# Altium project HeadControllerMILANDR.PrjPcb
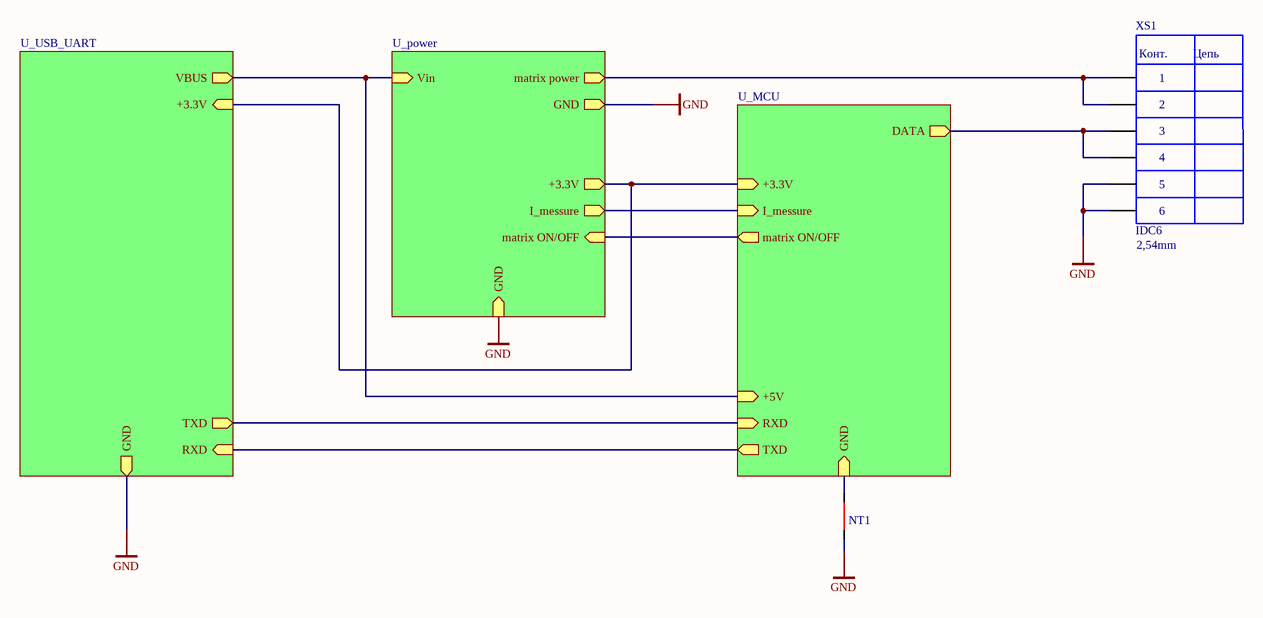
[diagram p0: HeadController.SchDoc]
4 sheets, 73 parts. Net scope: hierarchical (ports join the sheet entries above them; power ports are global).
Board file: HeadController_1.PcbDoc
Sheets:
  HeadController.SchDoc
    U_MCU = MCU.SchDoc
    U_USB_UART = USB_UART.SchDoc
    U_power = power.SchDoc

## Sheet HeadController.SchDoc
size A4

### Parts
NT1  (no value)  [NT]  (net tie, no BOM)
XS1  IDC6  Package: 2,54mm  [IDC-6 (2.54) (end face)]

### Sub-sheets
U_MCU = MCU.SchDoc: GND (in), RXD (in), TXD (out), I_messure (in), +5V (in), DATA (out), matrix ON/OFF (out), +3.3V (in)
U_power = power.SchDoc: Vin (in), I_messure (out), matrix ON/OFF (in), matrix power (out), GND (out), GND (in), +3.3V (out)
U_USB_UART = USB_UART.SchDoc: TXD (out), RXD (in), VBUS (out), GND (out), +3.3V (in)

### Nets
GND: NT1.2 XS1.5 XS1.6 ; sheet U_USB_UART/GND, sheet U_power/GND, sheet U_power/GND
MCU_GND: NT1.1 ; sheet U_MCU/GND
MCU_VCC: sheet U_MCU/+3.3V, sheet U_USB_UART/+3.3V, sheet U_power/+3.3V
OLED_VCC: sheet U_MCU/+5V, sheet U_USB_UART/VBUS, sheet U_power/Vin
I_MES: sheet U_MCU/I_messure, sheet U_power/I_messure
MATRIX_ON: sheet U_MCU/matrix ON/OFF, sheet U_power/matrix ON/OFF
UART1_RXD: sheet U_MCU/RXD, sheet U_USB_UART/TXD
UART1_TXD: sheet U_MCU/TXD, sheet U_USB_UART/RXD
NetDD3_4: XS1.3 XS1.4 ; sheet U_MCU/DATA
NetVT2_3: XS1.1 XS1.2 ; sheet U_power/matrix power

### Notes on the sheet
- (in symbol IDC6) Конт.; Цепь

### Library data of the parts
NT1 = NT
XS1 = IDC6: ValueBOM: Разъём IDC6 прямой; Type: XS; Value: IDC6

## Sheet MCU.SchDoc
size A2
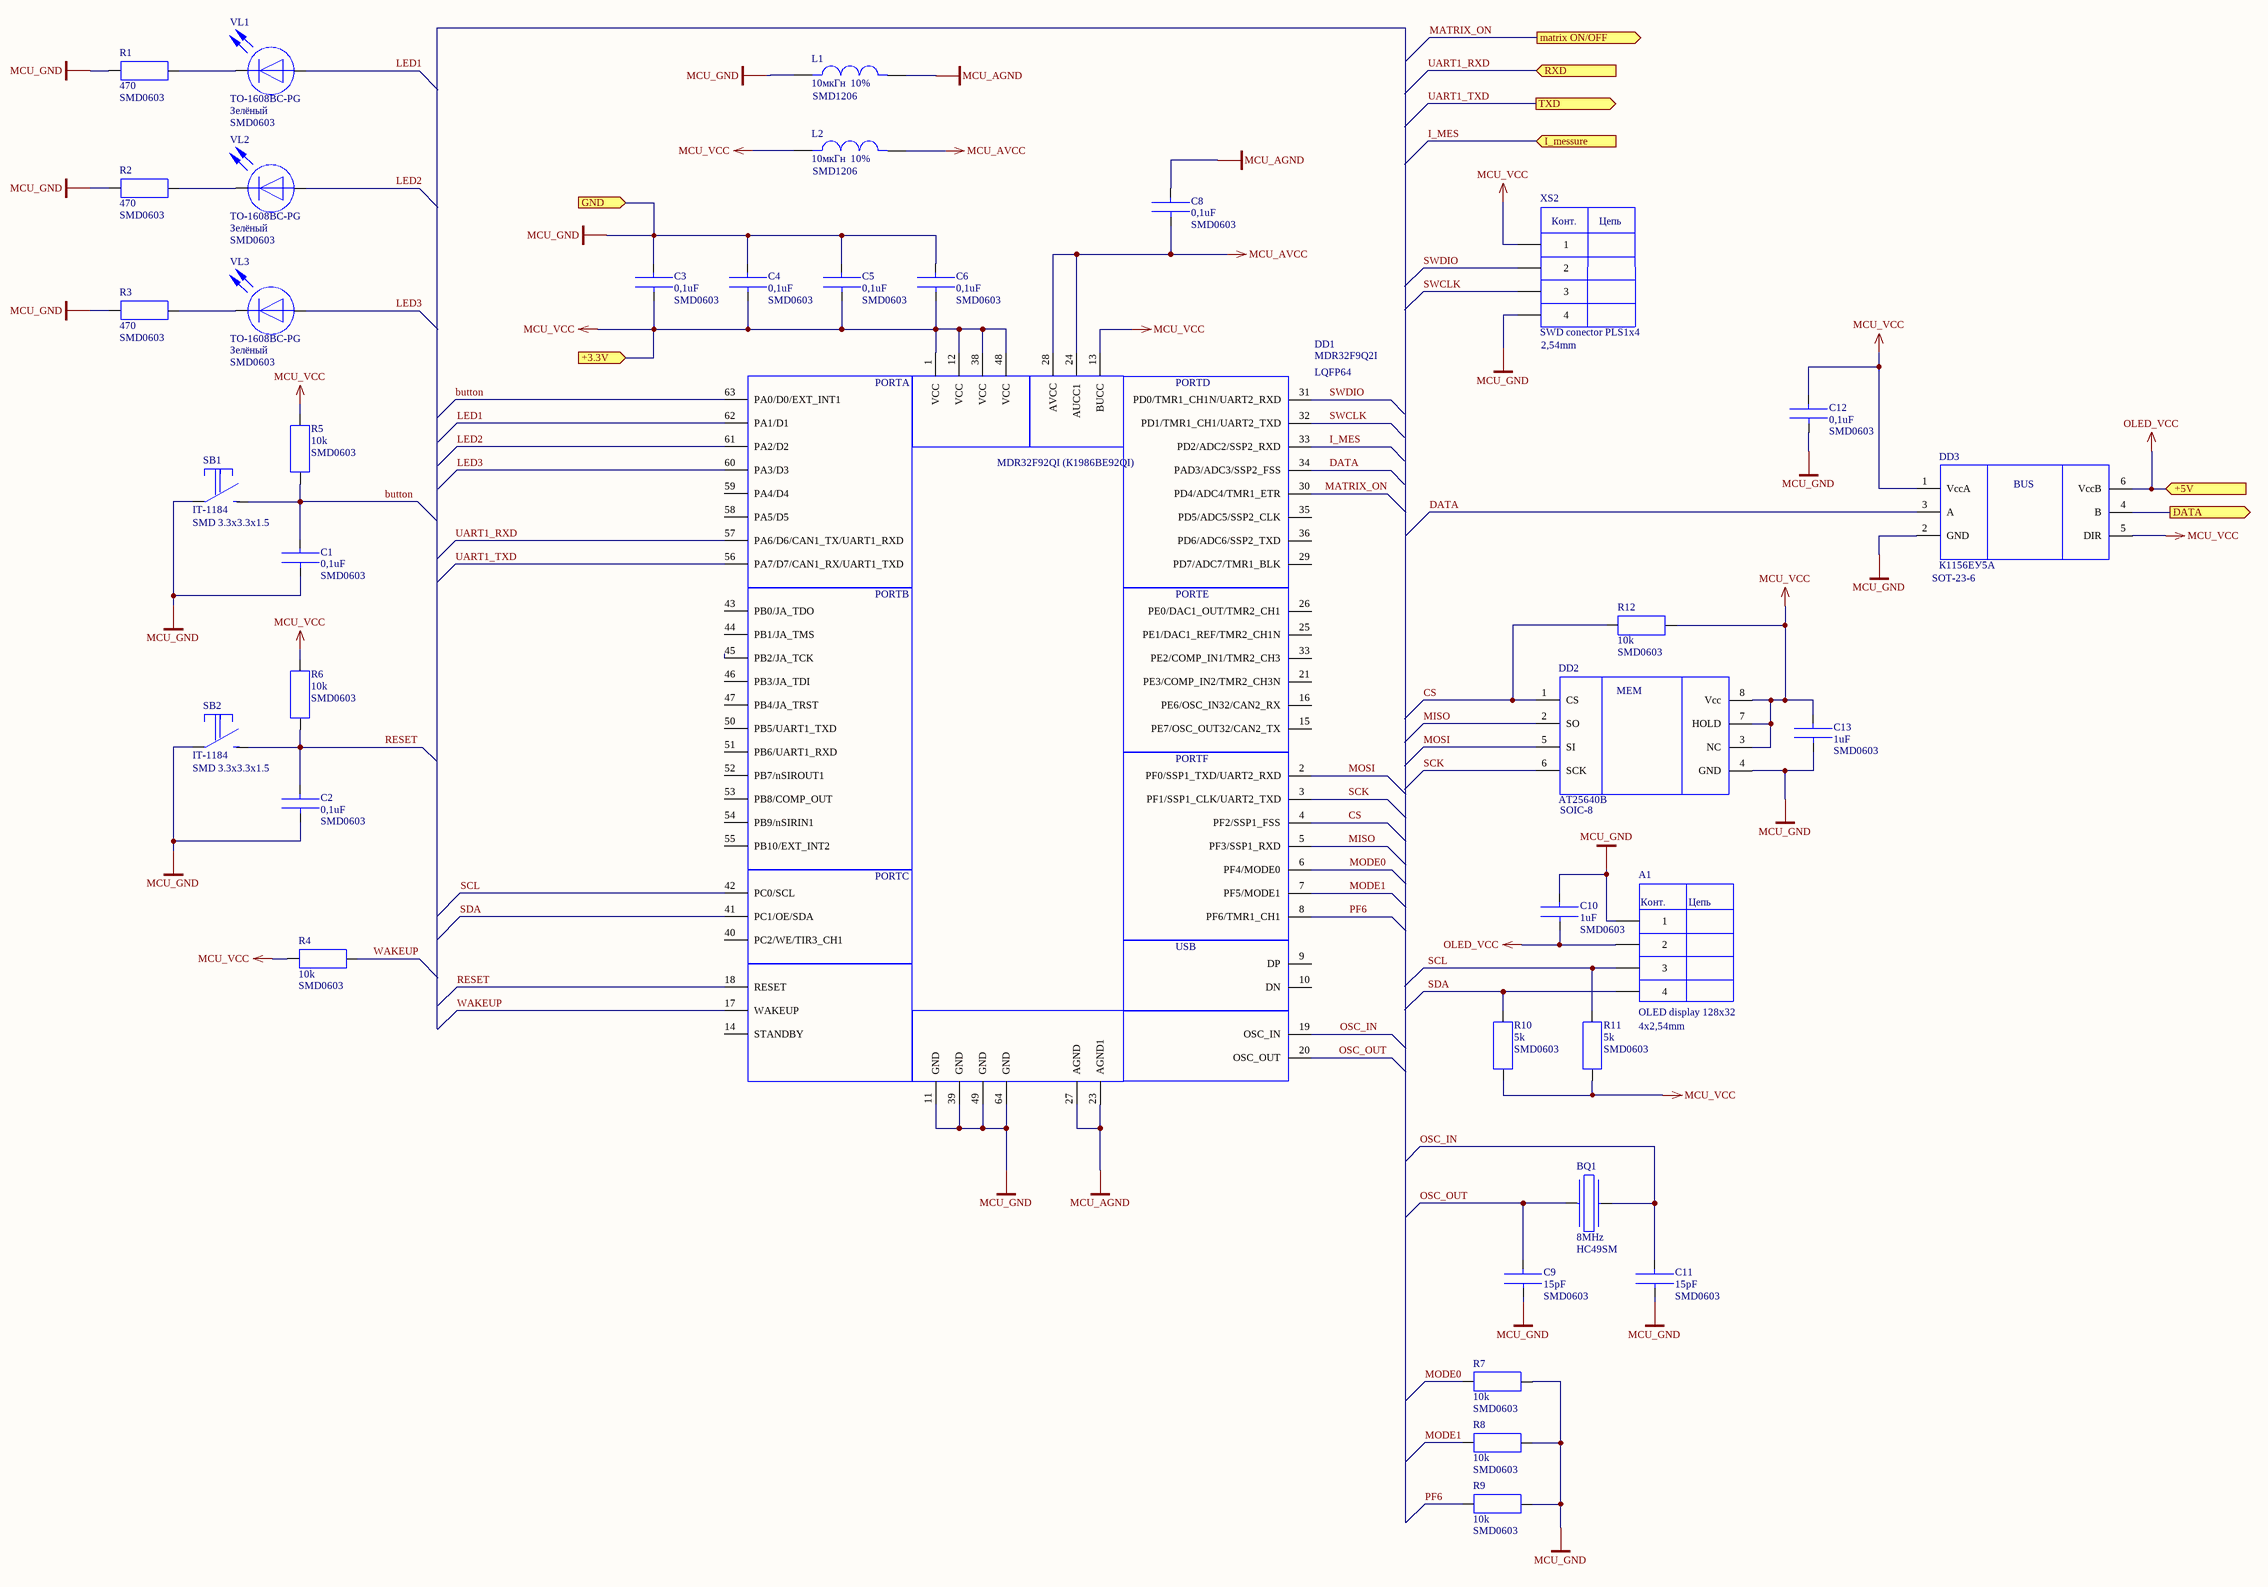
[diagram p1: MCU.SchDoc]

### Parts
A1  OLED display 128x32  Package: 4x2,54mm  [OLED 128x32]
BQ1  8МHz  Package: HC49SM  [BQ_HC49SM]
C1  0,1uF  Package: SMD0603  [SMD0603(1005)]
C2  0,1uF  Package: SMD0603  [SMD0603(1005)]
C3  0,1uF  Package: SMD0603  [SMD0603(1005)]
C4  0,1uF  Package: SMD0603  [SMD0603(1005)]
C5  0,1uF  Package: SMD0603  [SMD0603(1005)]
C6  0,1uF  Package: SMD0603  [SMD0603(1005)]
C8  0,1uF  Package: SMD0603  [SMD0603(1005)]
C9  15pF  Package: SMD0603  [SMD0603(1005)]
C10  1uF  Package: SMD0603  [SMD0603(1005)]
C11  15pF  Package: SMD0603  [SMD0603(1005)]
C12  0,1uF  Package: SMD0603  [SMD0603(1005)]
C13  1uF  Package: SMD0603  [SMD0603(1005)]
DD1  MDR32F9Q2I  Package: LQFP64  [LQFP-64]
DD2  AT25640B  Package: SOIC-8  [SOIC8]
DD3  К1156ЕУ5А  Package: SOT-23-6  [SOT23-6]
L1  10мкГн  10%  Package: SMD1206  [SMD1206(3216)]
L2  10мкГн  10%  Package: SMD1206  [SMD1206(3216)]
R1  470  Package: SMD0603  [SMD0603(1005)]
R2  470  Package: SMD0603  [SMD0603(1005)]
R3  470  Package: SMD0603  [SMD0603(1005)]
R4  10k  Package: SMD0603  [SMD0603(1005)]
R5  10k  Package: SMD0603  [SMD0603(1005)]
R6  10k  Package: SMD0603  [SMD0603(1005)]
R7  10k  Package: SMD0603  [SMD0603(1005)]
R8  10k  Package: SMD0603  [SMD0603(1005)]
R9  10k  Package: SMD0603  [SMD0603(1005)]
R10  5k  Package: SMD0603  [SMD0603(1005)]
R11  5k  Package: SMD0603  [SMD0603(1005)]
R12  10k  Package: SMD0603  [SMD0603(1005)]
SB1  IT-1184  Package: SMD 3.3x3.3x1.5  [IT-1184]
SB2  IT-1184  Package: SMD 3.3x3.3x1.5  [IT-1184]
VL1  TO-1608BC-PG  Light: Зелёный  Package: SMD0603  [LED_SMD0603(1005)]
VL2  TO-1608BC-PG  Light: Зелёный  Package: SMD0603  [LED_SMD0603(1005)]
VL3  TO-1608BC-PG  Light: Зелёный  Package: SMD0603  [LED_SMD0603(1005)]
XS2  SWD conector PLS1x4  Package: 2,54mm  [PLS1x4]

### Ports
+3.3V (in), +5V (in), DATA (out), GND (in), I_messure (in), matrix ON/OFF (out), RXD (in), TXD (out)

### Nets
MCU_AGND: C8.1 DD1.23(AGND1) DD1.27(AGND) L1.2(IN1)
MCU_AVCC: C8.2 DD1.24(AUCC1) DD1.28(AVCC) L2.2(IN1)
MCU_GND: A1.1 C1.2 C2.2 C3.1 C4.1 C5.1 C6.1 C9.1 C10.1 C11.1 C12.2 C13.2 DD1.11(GND) DD1.39(GND) DD1.49(GND) DD1.64(GND) DD2.4(GND) DD3.2(GND) L1.1(IN1) R1.2 R2.2 R3.2 R7.1 R8.1 R9.1 SB1.1 SB2.1 XS2.4 ; port GND
MCU_VCC: C3.2 C4.2 C5.2 C6.2 C12.1 C13.1 DD1.1(VCC) DD1.12(VCC) DD1.13(BUCC) DD1.38(VCC) DD1.48(VCC) DD2.3(NC) DD2.7(HOLD) DD2.8(Vcc) DD3.1(VccA) DD3.5(DIR) L2.1(IN1) R4.2 R5.2 R6.2 R10.1 R11.1 R12.2 XS2.1 ; port +3.3V
OLED_VCC: A1.2 C10.2 DD3.6(VccB) ; port +5V
button: C1.1 DD1.63(PA0/D0/EXT_INT1) R5.1 SB1.2
CS: DD1.4(PF2/SSP1_FSS) DD2.1(CS) R12.1
DATA: DD1.34(PAD3/ADC3/SSP2_FSS) DD3.3(A)
I_MES: DD1.33(PD2/ADC2/SSP2_RXD) ; port I_messure
LED1: DD1.62(PA1/D1) VL1.1
LED2: DD1.61(PA2/D2) VL2.1
LED3: DD1.60(PA3/D3) VL3.1
MATRIX_ON: DD1.30(PD4/ADC4/TMR1_ETR) ; port matrix ON/OFF
MISO: DD1.5(PF3/SSP1_RXD) DD2.2(SO)
MODE0: DD1.6(PF4/MODE0) R7.2
MODE1: DD1.7(PF5/MODE1) R8.2
MOSI: DD1.2(PF0/SSP1_TXD/UART2_RXD) DD2.5(SI)
OSC_IN: BQ1.2 C11.2 DD1.19(OSC_IN)
OSC_OUT: BQ1.1 C9.2 DD1.20(OSC_OUT)
PF6: DD1.8(PF6/TMR1_CH1) R9.2
RESET: C2.1 DD1.18(RESET) R6.1 SB2.2
SCK: DD1.3(PF1/SSP1_CLK/UART2_TXD) DD2.6(SCK)
SCL: A1.3 DD1.42(PC0/SCL) R11.2
SDA: A1.4 DD1.41(PC1/OE/SDA) R10.2
SWCLK: DD1.32(PD1/TMR1_CH1/UART2_TXD) XS2.3
SWDIO: DD1.31(PD0/TMR1_CH1N/UART2_RXD) XS2.2
UART1_RXD: DD1.57(PA6/D6/CAN1_TX/UART1_RXD) ; port RXD
UART1_TXD: DD1.56(PA7/D7/CAN1_RX/UART1_TXD) ; port TXD
WAKEUP: DD1.17(WAKEUP) R4.1
NetDD3_4: DD3.4(B) ; port DATA
NetR1_1: R1.1 VL1.2
NetR2_1: R2.1 VL2.2
NetR3_1: R3.1 VL3.2

Not connected (* = marked no-connect by the designer): DD1 9(DP) 10(DN) 14(STANDBY) 15(PE7/OSC_OUT32/CAN2_TX) 16(PE6/OSC_IN32/CAN2_RX) 21(PE3/COMP_IN2/TMR2_CH3N) 25(PE1/DAC1_REF/TMR2_CH1N) 26(PE0/DAC1_OUT/TMR2_CH1) 29(PD7/ADC7/TMR1_BLK) 35(PD5/ADC5/SSP2_CLK) 36(PD6/ADC6/SSP2_TXD) 40(PC2/WE/TIR3_CH1) 43(PB0/JA_TDO) 44(PB1/JA_TMS) 45(PB2/JA_TCK) 46(PB3/JA_TDI) 47(PB4/JA_TRST) 50(PB5/UART1_TXD) 51(PB6/UART1_RXD) 52(PB7/nSIROUT1) 53(PB8/COMP_OUT) 54(PB9/nSIRIN1) 55(PB10/EXT_INT2) 58(PA5/D5) 59(PA4/D4)

### Notes on the sheet
- Title
- Size:
- Date:
- File:
- A2
- Number:
- Time:
- Revision:
- Sheet
- of
- (in symbol MDR32F9Q2I) PORTA; PORTD; MDR32F92QI (К1986ВЕ92QI); PORTB; PORTE; PORTF; PORTC; USB
- (in symbol PLS1x4) Конт.; Цепь
- (in symbol Дисплей OLED 128x32) Конт.; Цепь
- (in symbol Микросхема AT25640B) MEM
- (in symbol Микросхема SN74LVC1T45DBVR) BUS
- (in symbol OLED) Цепь; Конт.; GND; Vcc; SCL; SDA

### Library data of the parts
A1 = Дисплей OLED 128x32: Type: A; Value: OLED display 128x32; ValueBOM: Дисплей OLED 128x32
BQ1 = BQ_HC49SM: ValueBOM: Кварцевый резонатор 8МГц HC49S; Type: BQ; Value: 8МHz
C1-C6 C8 C12 = CER_CUP_0603: Type: C; ValueBOM: Конденсатор керамический 0,1мкФ SMD 0603 1%; Value: 0,1uF
C9 C11 = CER_CUP_0603: Type: C; ValueBOM: Конденсатор керамический 15пФ SMD 0603 1%; Value: 15pF
C10 C13 = CER_CUP_0603: Type: C; ValueBOM: Конденсатор керамический 1мкФ SMD 0603 1%; Value: 1uF
DD1 = MDR32F9Q2I: ValueBOM: Микроконтроллер MDR32F9Q2I (К1986ВЕ92QI) LQFP64; Type: DD; Value: MDR32F9Q2I
DD2 = Микросхема AT25640B: ValueBOM: Микросхема EEPROM AT25640B; Value: AT25640B; Type: DD
DD3 = Микросхема SN74LVC1T45DBVR: 1-битный шинный приемопередатчик с двуполярным питанием, тремя состояниями на выходе; ValueBOM: Микросхема К1156ЕУ5А; Type: DD; Value: К1156ЕУ5А
L1 L2 = L1: ValueBOM: Индуктивность 10 мкГн, SMD1206, 10%; Type: L; Value: 10мкГн  10%
R1-R3 = R_0603: ValueBOM: Резистор 470 Ом SMD 0603 1%; Type: R; Value: 470
R4-R9 R12 = R_0603: ValueBOM: Резистор 10кОм SMD 0603 1%; Type: R; Value: 10k
R10 R11 = R_0603: ValueBOM: Резистор 5кОм SMD 0603 1%; Type: R; Value: 5k
SB1 SB2 = Кнопка тактовая (универсальная): ValueBOM: Кнопка тактовая IT1184; Type: SB; Value: IT-1184
VL1-VL3 = LED_0603: ValueBOM: Светодиод зелёный TO-1608BC-PG SMD0603; Type: VL; Value: TO-1608BC-PG
XS2 = PLS1x4: ValueBOM: Разъём PLS1x4 прямой; Type: XS; Value: SWD conector PLS1x4

## Sheet USB_UART.SchDoc
size A4
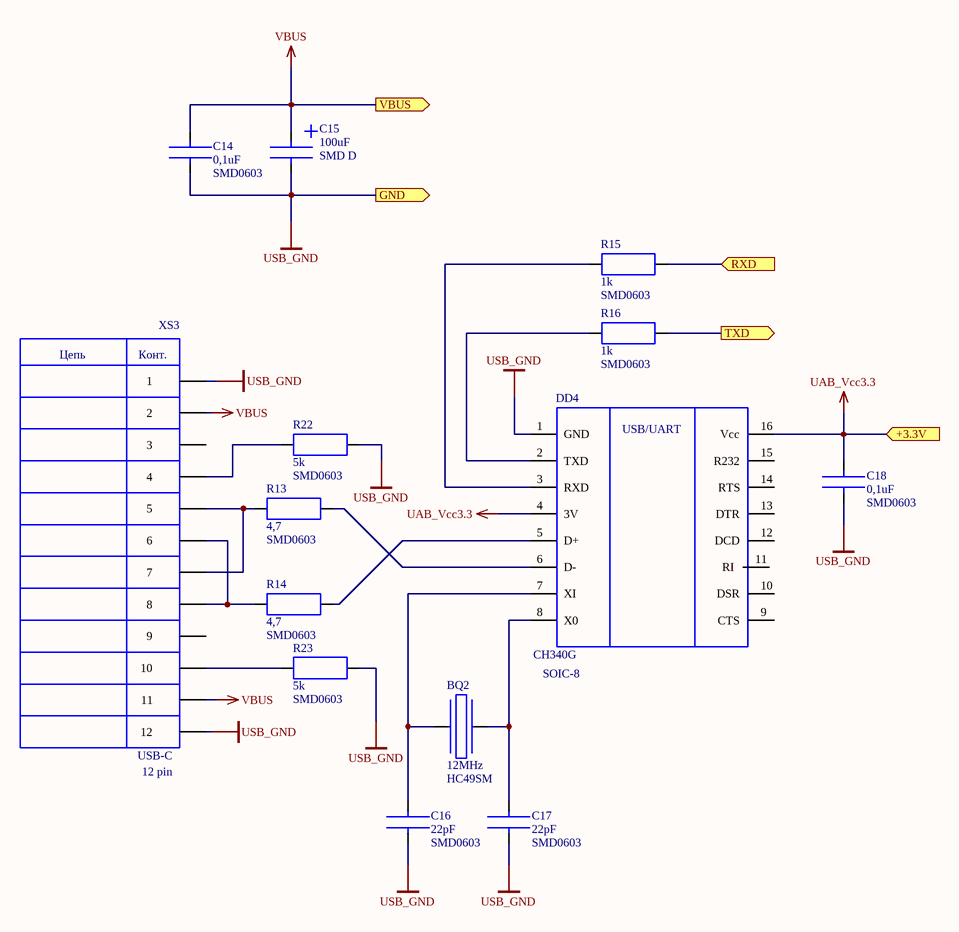
[diagram p2: USB_UART.SchDoc]

### Parts
BQ2  12МHz  Package: HC49SM  [BQ_HC49SM]
C14  0,1uF  Package: SMD0603  [SMD0603(1005)]
C15  100uF  Package: SMD D  [TANT_CAP_D(7343)]
C16  22pF  Package: SMD0603  [SMD0603(1005)]
C17  22pF  Package: SMD0603  [SMD0603(1005)]
C18  0,1uF  Package: SMD0603  [SMD0603(1005)]
DD4  CH340G  Package: SOIC-8  [SOIC16]
R13  4,7  Package: SMD0603  [SMD0603(1005)]
R14  4,7  Package: SMD0603  [SMD0603(1005)]
R15  1k  Package: SMD0603  [SMD0603(1005)]
R16  1k  Package: SMD0603  [SMD0603(1005)]
R22  5k  Package: SMD0603  [SMD0603(1005)]
R23  5k  Package: SMD0603  [SMD0603(1005)]
XS3  USB-C  Package: 12 pin  [USB_C]

### Ports
+3.3V (in), GND (out), RXD (in), TXD (out), VBUS (out)

### Nets
UAB_Vcc3.3: C18.2 DD4.4(3V) DD4.16(Vcc) ; port +3.3V  [project net MCU_VCC]
USB_GND: C14.1 C15.2 C16.1 C17.1 C18.1 DD4.1(GND) R22.1 R23.1 XS3.1 XS3.12 ; port GND  [project net GND]
VBUS: C14.2 C15.1 XS3.2 XS3.11 ; port VBUS  [project net OLED_VCC]
UART1_RXD: R16.1 ; port TXD
UART1_TXD: R15.1 ; port RXD
NetBQ2_1: BQ2.1 C16.2 DD4.7(XI)
NetBQ2_2: BQ2.2 C17.2 DD4.8(X0)
NetDD4_2: DD4.2(TXD) R16.2
NetDD4_3: DD4.3(RXD) R15.2
NetDD4_5: DD4.5(D+) R14.2
NetDD4_6: DD4.6(D-) R13.2
NetR13_1: R13.1 XS3.5 XS3.7
NetR14_1: R14.1 XS3.6 XS3.8
NetR22_2: R22.2 XS3.4
NetR23_2: R23.2 XS3.10

Not connected (* = marked no-connect by the designer): DD4 9(CTS) 10(DSR) 11(RI) 12(DCD) 13(DTR) 14(RTS) 15(R232); XS3 3 9

### Notes on the sheet
- (in symbol USB_C) Цепь; Конт.
- (in symbol Микросхема CH340G) USB/UART

### Library data of the parts
BQ2 = BQ_HC49SM: ValueBOM: Кварцевый резонатор 12МГц HC49S; Type: BQ; Value: 12МHz
C14 C18 = CER_CUP_0603: as C1 on sheet MCU; Value: 0,1uF
C15 = C_TANT_D: Type: C; ValueBOM: Конденсатор танталовый 100мкФ х 16В 10%  SMD D; Value: 100uF
C16 C17 = CER_CUP_0603: Type: C; ValueBOM: Конденсатор керамический 22пФ SMD 0603 1%; Value: 22pF
DD4 = Микросхема CH340G: Type: DD; Value: CH340G; ValueBOM: Микросхема CH340G
R13 R14 = R_0603: ValueBOM: Резистор 4,7Ом SMD 0603 1%; Type: R; Value: 4,7
R15 R16 = R_0603: ValueBOM: Резистор 1кОм SMD 0603 1%; Type: R; Value: 1k
R22 R23 = R_0603: ValueBOM: Резистор 5кОм SMD 0603 1%; Type: R; Value: 5k
XS3 = USB_C: ValueBOM: Разъём USB type C 12 контактный; Value: USB-C; Type: XS; Link: https://www.voltmaster-samara.ru/upload/iblock/68a/68a6841d20080b30588d6f36d0bc1a38.pdf

## Sheet power.SchDoc
size A4
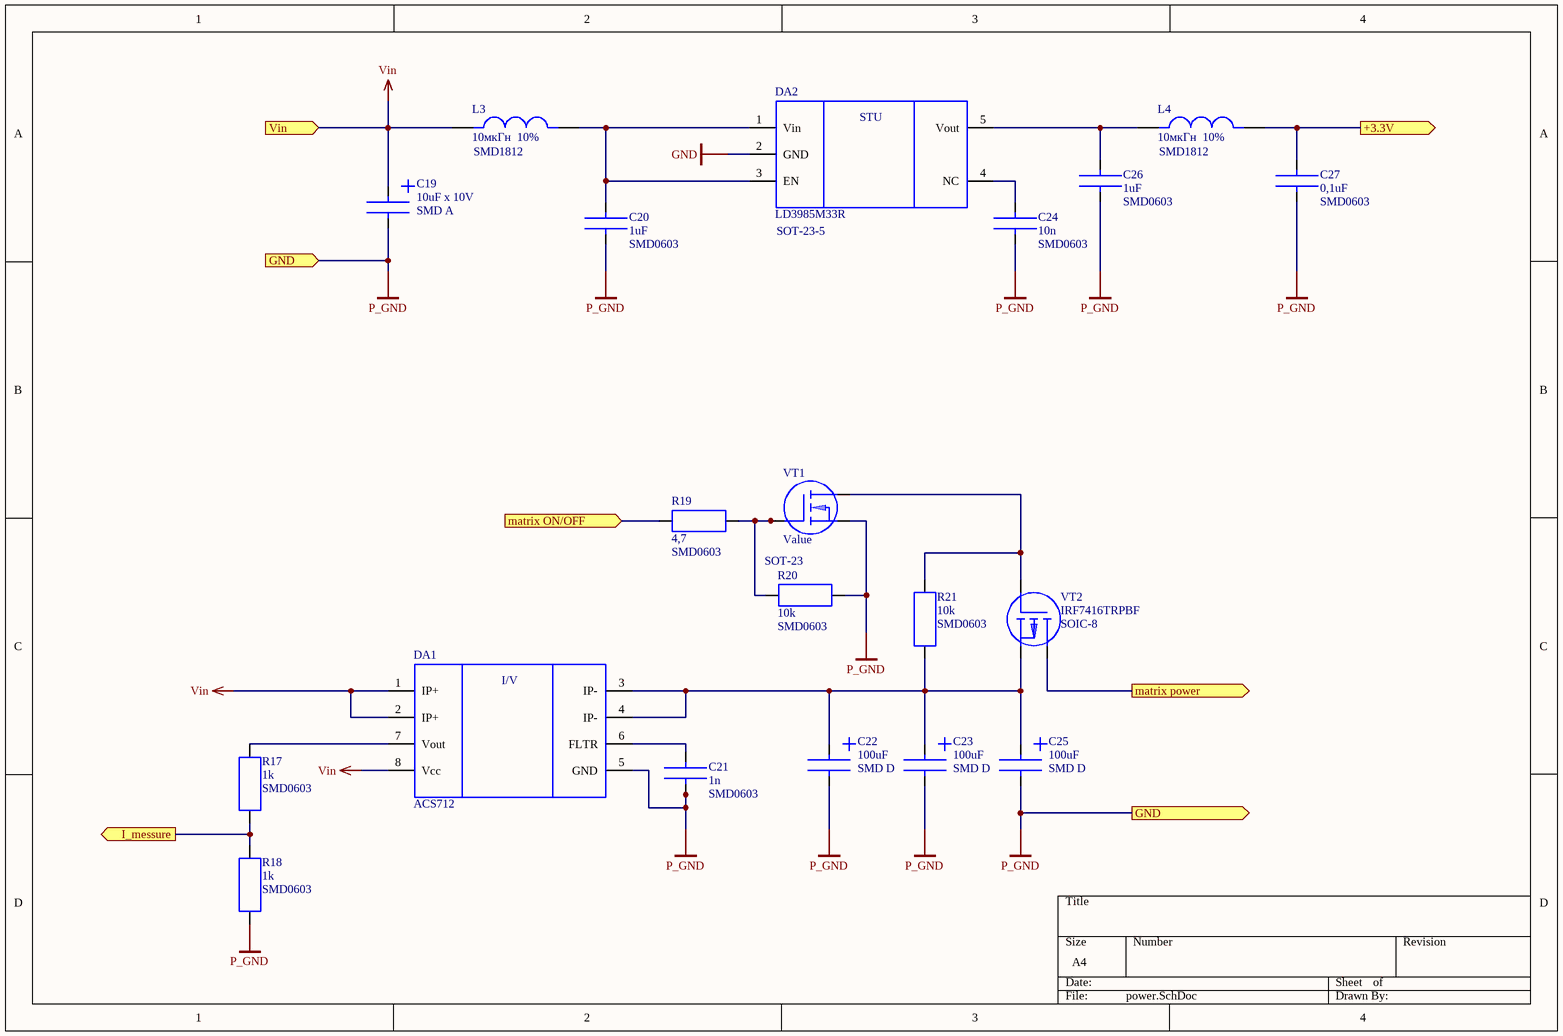
[diagram p3: power.SchDoc]

### Parts
C19  10uF x 10V  Package: SMD A  [TANT_CAP_A(3216)]
C20  1uF  Package: SMD0603  [SMD0603(1005)]
C21  1n  Package: SMD0603  [SMD0603(1005)]
C22  100uF  Package: SMD D  [TANT_CAP_D(7343)]
C23  100uF  Package: SMD D  [TANT_CAP_D(7343)]
C24  10n  Package: SMD0603  [SMD0603(1005)]
C25  100uF  Package: SMD D  [TANT_CAP_D(7343)]
C26  1uF  Package: SMD0603  [SMD0603(1005)]
C27  0,1uF  Package: SMD0603  [SMD0603(1005)]
DA1  ACS712  [SOIC8]
DA2  LD3985M33R  Package: SOT-23-5  [SOT23-5]
L3  10мкГн  10%  Package: SMD1812  [SMD2010(5025)]
L4  10мкГн  10%  Package: SMD1812  [SMD2010(5025)]
R17  1k  Package: SMD0603  [SMD0603(1005)]
R18  1k  Package: SMD0603  [SMD0603(1005)]
R19  4,7  Package: SMD0603  [SMD0603(1005)]
R20  10k  Package: SMD0603  [SMD0603(1005)]
R21  10k  Package: SMD0603  [SMD0603(1005)]
VT1  Value  Package: SOT-23  [SOT23-3]
VT2  IRF7416TRPBF  Package: SOIC-8  [VT_SOIC8]

### Ports
+3.3V (out), GND (in), GND (out), I_messure (out), matrix ON/OFF (in), matrix power (out), Vin (in)

### Nets
GND: C19.2 C20.2 C21.2 C22.2 C23.2 C24.2 C25.2 C26.2 C27.2 DA1.5(GND) DA2.2(GND) R18.2 R20.2 VT1.2 ; port GND  [also labelled P_GND]
MCU_VCC: C27.1 L4.2(IN1) ; port +3.3V
Vin: C19.1 DA1.1(IP+) DA1.2(IP+) DA1.8(Vcc) L3.1(IN1) ; port Vin  [project net OLED_VCC]
I_MES: R17.2 R18.1 ; port I_messure
MATRIX_ON: R19.1 ; port matrix ON/OFF
NetC20_1: C20.1 DA2.1(Vin) DA2.3(EN) L3.2(IN1)
NetC21_1: C21.1 DA1.6(FLTR)
NetC22_1: C22.1 C23.1 C25.1 DA1.3(IP-) DA1.4(IP-) R21.2 VT2.1
NetC24_1: C24.1 DA2.4(NC)
NetC26_1: C26.1 DA2.5(Vout) L4.1(IN1)
NetDA1_7: DA1.7(Vout) R17.1
NetR19_2: R19.2 R20.1 VT1.1
NetR21_1: R21.1 VT1.3 VT2.2
NetVT2_3: VT2.3 ; port matrix power

### Notes on the sheet
- (in symbol LD3985M33R) STU
- (in symbol Микросхема ACS712) I/V

### Library data of the parts
C19 = C_TANT_A: Type: C; ValueBOM: Конденсатор танталовый 10мкФ х 10В SMD A; Value: 10uF x 10V
C20 C26 = CER_CUP_0603: as C10 on sheet MCU; Value: 1uF
C21 = CER_CUP_0603: Type: C; ValueBOM: Конденсатор керамический 1нФ х 50В SMD 0603 1%; Value: 1n
C22 C23 C25 = C_TANT_D: as C15 on sheet USB_UART; Value: 100uF
C24 = CER_CUP_0603: Type: C; ValueBOM: Конденсатор керамический 10нФ х 50В SMD 0603 1%; Value: 10n
C27 = CER_CUP_0603: as C1 on sheet MCU; Value: 0,1uF
DA1 = Микросхема ACS712: Value: ACS712; Type: DA; ValueBOM: Микросхема ACS712
DA2 = LD3985M33R: ValueBOM: Микросхема LD3985M33R, SOT-23-5; Value: LD3985M33R; Type: DA
L3 L4 = L1: ValueBOM: Индуктивность B82432-C1103-K, 10 мкГн, SMD1812, 10%; Type: L; Value: 10мкГн  10%
R17 R18 = R_0603: ValueBOM: Резистор 1кОм SMD 0603 1%; Type: R; Value: 1k
R19 = R_0603: ValueBOM: Резистор 4,7Ом SMD 0603 1%; Type: R; Value: 4,7
R20 R21 = R_0603: ValueBOM: Резистор 10кОм SMD 0603 1%; Type: R; Value: 10k
VT1 = VT_N_MOSFET_SOT23_3: Type: VT; ValueBOM: Транзистор n-МОП Value SOT23; Value: Value
VT2 = Транзистор IRF7416TRPBF: Type: VT; ValueBOM: Транзистор p-МОП IRF7416TRPBF, SOIC-8; Value: IRF7416TRPBF

## Nets that join several sheets
GND: HeadController (NT1.2 XS1.5 XS1.6), USB_UART (10 pins), power (14 pins)
MCU_GND: HeadController (NT1.1), MCU (28 pins)
MCU_VCC: MCU (24 pins), USB_UART (C18.2 DD4.4 DD4.16), power (C27.1 L4.2)
OLED_VCC: MCU (A1.2 C10.2 DD3.6), USB_UART (C14.2 C15.1 XS3.2 XS3.11), power (5 pins)
I_MES: MCU (DD1.33), power (R17.2 R18.1)
MATRIX_ON: MCU (DD1.30), power (R19.1)
NetDD3_4: HeadController (XS1.3 XS1.4), MCU (DD3.4)
NetVT2_3: HeadController (XS1.1 XS1.2), power (VT2.3)
UART1_RXD: MCU (DD1.57), USB_UART (R16.1)
UART1_TXD: MCU (DD1.56), USB_UART (R15.1)